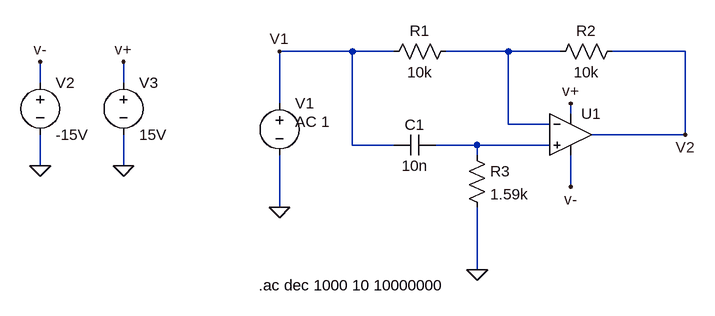
[diagram p0: schematic PasaTodo.asc]
PasaTodo.asc, the LTspice schematic file:
Version 4.1
SHEET 1 880 680
WIRE -336 -96 -448 -96
WIRE -272 -96 -336 -96
WIRE -96 -96 -192 -96
WIRE -16 -96 -96 -96
WIRE 176 -96 64 -96
WIRE -816 -48 -816 -80
WIRE -688 -48 -688 -80
WIRE -448 -16 -448 -96
WIRE 0 0 0 -16
WIRE -96 16 -96 -96
WIRE -32 16 -96 16
WIRE 176 32 176 -96
WIRE 176 32 32 32
WIRE -336 48 -336 -96
WIRE -272 48 -336 48
WIRE -144 48 -208 48
WIRE -32 48 -144 48
WIRE -144 64 -144 48
WIRE -816 80 -816 32
WIRE -688 80 -688 32
WIRE 0 112 0 64
WIRE -448 144 -448 64
WIRE -144 240 -144 144
FLAG -144 240 0
FLAG -448 144 0
FLAG 176 32 V2
FLAG -448 -96 V1
FLAG -816 80 0
FLAG -688 80 0
FLAG -688 -80 v+
FLAG -816 -80 v-
FLAG 0 112 v-
FLAG 0 -16 v+
SYMBOL cap -208 32 R90
WINDOW 0 0 32 VBottom 2
WINDOW 3 32 32 VTop 2
SYMATTR InstName C1
SYMATTR Value 10n
SYMBOL res -176 -112 R90
WINDOW 0 0 56 VBottom 2
WINDOW 3 32 56 VTop 2
SYMATTR InstName R1
SYMATTR Value 10k
SYMBOL res 80 -112 R90
WINDOW 0 0 56 VBottom 2
WINDOW 3 32 56 VTop 2
SYMATTR InstName R2
SYMATTR Value 10k
SYMBOL res -160 48 R0
SYMATTR InstName R3
SYMATTR Value 1.59k
SYMBOL voltage -448 -32 R0
WINDOW 123 24 44 Left 2
WINDOW 39 0 0 Left 0
SYMATTR InstName V1
SYMATTR Value ""
SYMATTR Value2 AC 1
SYMBOL OpAmps\\UniversalOpAmp2 0 32 R0
SYMATTR InstName U1
SYMBOL voltage -816 -64 R0
WINDOW 123 0 0 Left 0
WINDOW 39 0 0 Left 0
SYMATTR InstName V2
SYMATTR Value -15V
SYMBOL voltage -688 -64 R0
WINDOW 123 0 0 Left 0
WINDOW 39 0 0 Left 0
SYMATTR InstName V3
SYMATTR Value 15V
TEXT -480 264 Left 2 !.ac dec 1000 10 10000000

The netlist it stands for:
* PasaTodo.asc
C1 N002 V1 10n
R1 N001 V1 10k
R2 V2 N001 10k
R3 N002 0 1.59k
V1 V1 0 AC 1
X§U1 N002 N001 v+ v- V2 level2 Avol=1Meg GBW=10Meg Slew=10Meg Ilimit=25m Rail=0 Vos=0 En=0 Enk=0 In=0 Ink=0 Rin=500Meg  ; pins In+ In- V+ V- OUT
V2 v- 0 -15V
V3 v+ 0 15V
.ac dec 1000 10 10000000
.lib UniversalOpAmp2.lib
.backanno
.end